# Altium schematic sheet [1]_MCU_Breakout.SchDoc
size A4; Author: Tomislav Ivaniš; Engineer: Tomislav Ivaniš
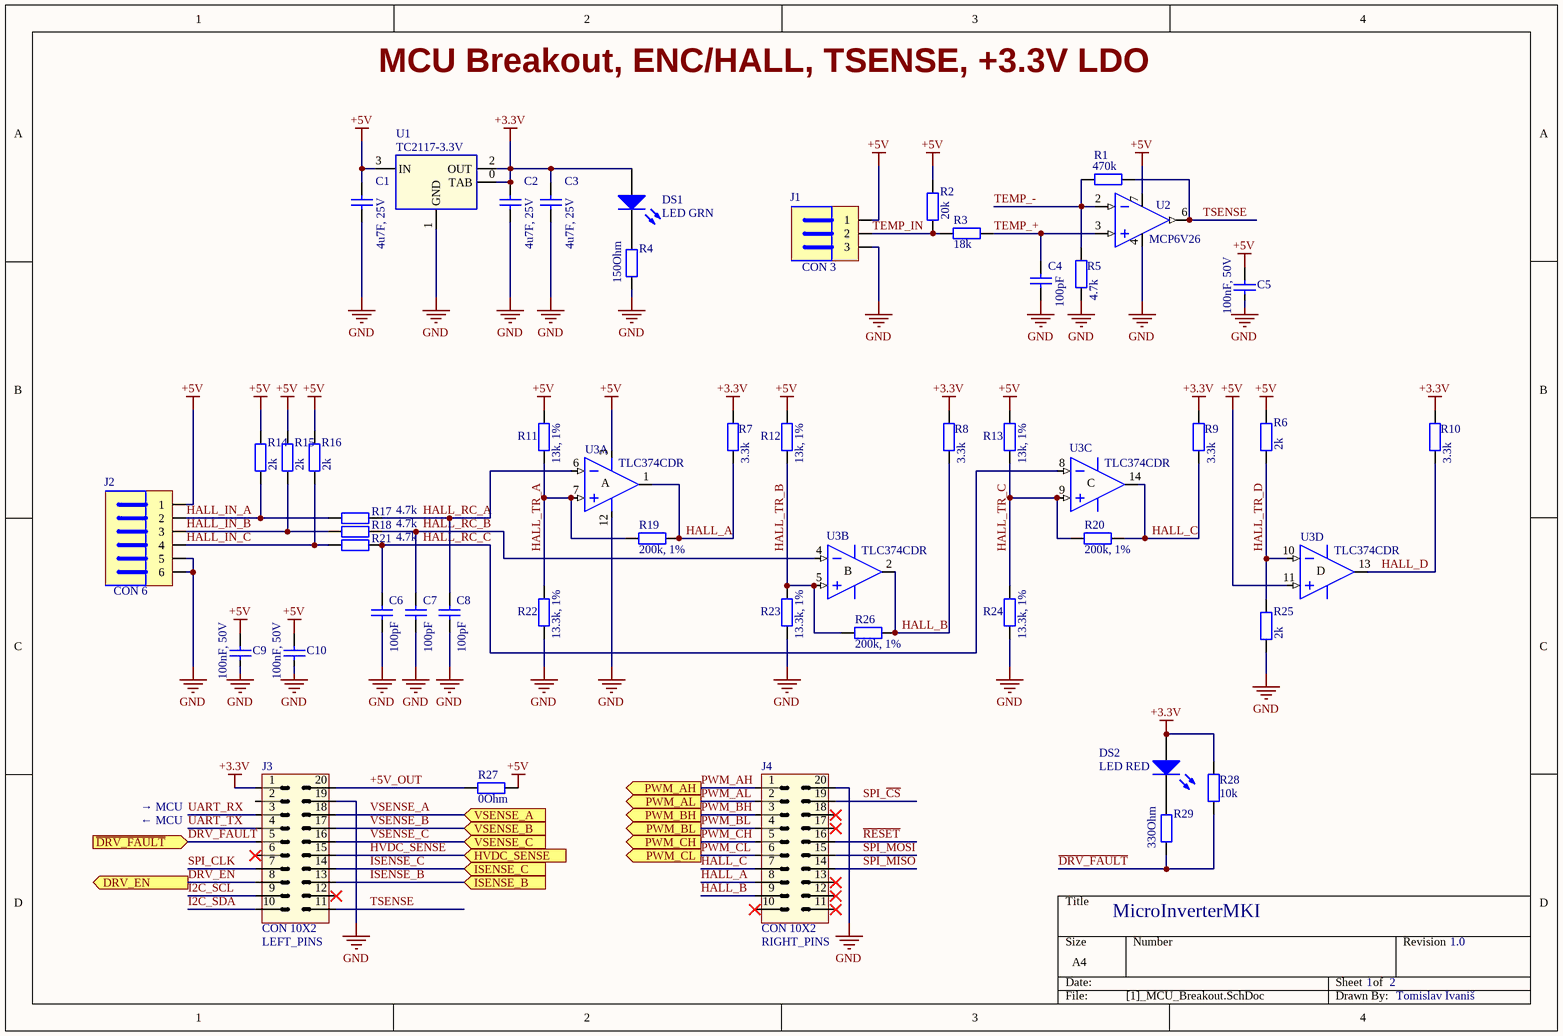
[diagram p0: [1]_MCU_Breakout.SchDoc]

## Parts
C1  4u7F, 25V  [0805]
C2  4u7F, 25V  [0805]
C3  4u7F, 25V  [0805]
C4  100pF  [0603]
C5  100nF, 50V  [0603]
C6  100pF  [0603]
C7  100pF  [0603]
C8  100pF  [0603]
C9  100nF, 50V  [0603]
C10  100nF, 50V  [0603]
DS1  LED GRN  [0805LED]
DS2  LED RED  [0805LED]
J1  CON 3  [CON 3 MOLEX SL]
J2  CON 6  [CON 6 MOLEX SL]
J3  CON 10X2  [CON 20 HEADER - (ALT) - INVERTED]
J4  CON 10X2  [CON 20 HEADER - (ALT) - INVERTED]
R1  470k  [0805]
R2  20k  [0805]
R3  18k  [0805]
R4  150Ohm  [0805]
R5  4.7k  [0805]
R6  2k  [0805]
R7  3.3k  [0805]
R8  3.3k  [0805]
R9  3.3k  [0805]
R10  3.3k  [0805]
R11  13k, 1%  [0805]
R12  13k, 1%  [0805]
R13  13k, 1%  [0805]
R14  2k  [0805]
R15  2k  [0805]
R16  2k  [0805]
R17  4.7k  [0805]
R18  4.7k  [0805]
R19  200k, 1%  [0805]
R20  200k, 1%  [0805]
R21  4.7k  [0805]
R22  13.3k, 1%  [0805]
R23  13.3k, 1%  [0805]
R24  13.3k, 1%  [0805]
R25  2k  [0805]
R26  200k, 1%  [0805]
R27  0Ohm  [0805]
R28  10k  [0805]
R29  330Ohm  [0805]
U1  TC2117-3.3V  [SOT223 (ZLDO)]
U2  MCP6V26  [SOIC 8-pin]
U3  TLC374CDR  [SOIC14]  (parts A,B,C,D of 4)

## Ports
DRV_EN (out), HVDC_SENSE (in), ISENSE_B (in), ISENSE_C (in), PWM_AH (out), PWM_AL (out), PWM_BH (out), PWM_BL (out), PWM_CH (out), PWM_CL (out), VSENSE_A (in), VSENSE_B (in), VSENSE_C (in), ~{DRV_FAULT} (in)

## Nets
+3.3V: C2.1 C3.1 DS1.2(A) DS2.2(A) J3.1 R7.1 R8.1 R9.1 R10.1 R28.2 U1.0(TAB) U1.2(OUT)
+5V: C1.1 C5.1 C9.1 C10.1 J1.1 J2.1 R2.1 R6.1 R11.1 R12.1 R13.1 R14.1 R15.1 R16.1 R27.2 U1.3(IN) U2.7 U3.3(VDD) U3.11(IN+)
GND: C1.2 C2.2 C3.2 C4.2 C5.2 C6.2 C7.2 C8.2 C9.2 C10.2 J1.3 J2.5 J2.6 J3.19 J4.20 R4.2 R5.1 R22.2 R23.2 R24.2 R25.2 U1.1(GND) U2.4 U3.12(GND)
+5V_OUT: J3.20 R27.1
~{DRV_FAULT}: J3.5 R28.1 R29.2 ; port ~{DRV_FAULT}
DRV_EN: J3.8 ; port DRV_EN
HALL_A: J4.8 R7.2 R19.2 U3.1(OUT)
HALL_B: J4.9 R8.2 R26.2 U3.2(OUT)
HALL_C: J4.7 R9.2 R20.2 U3.14(OUT)
HALL_D: R10.2 U3.13(OUT)
HALL_IN_A: J2.2 R14.2 R17.1
HALL_IN_B: J2.3 R15.2 R18.1
HALL_IN_C: J2.4 R16.2 R21.1
HALL_RC_A: C8.1 R17.2 U3.6(IN-)
HALL_RC_B: C7.1 R18.2 U3.4(IN-)
HALL_RC_C: C6.1 R21.2 U3.8(IN-)
HALL_TR_A: R11.2 R19.1 R22.1 U3.7(IN+)
HALL_TR_B: R12.2 R23.1 R26.1 U3.5(IN+)
HALL_TR_C: R13.2 R20.1 R24.1 U3.9(IN+)
HALL_TR_D: R6.2 R25.1 U3.10(IN-)
HVDC_SENSE: J3.15 ; port HVDC_SENSE
I2C_SCL: J3.9
I2C_SDA: J3.10
ISENSE_B: J3.13 ; port ISENSE_B
ISENSE_C: J3.14 ; port ISENSE_C
PWM_AH: J4.1 ; port PWM_AH
PWM_AL: J4.2 ; port PWM_AL
PWM_BH: J4.3 ; port PWM_BH
PWM_BL: J4.4 ; port PWM_BL
PWM_CH: J4.5 ; port PWM_CH
PWM_CL: J4.6 ; port PWM_CL
~{RESET}: J4.16
SPI_~{CS}: J4.19
SPI_CLK: J3.7
SPI_MISO: J4.14
SPI_MOSI: J4.15
TEMP_+: C4.1 R3.2 U2.3(IN+)
TEMP_-: R1.2 R5.2 U2.2(IN-)
TEMP_IN: J1.2 R2.2 R3.1
TSENSE: J3.11 R1.1 U2.6(OUT)
UART_RX: J3.3
UART_TX: J3.4
VSENSE_A: J3.18 ; port VSENSE_A
VSENSE_B: J3.17 ; port VSENSE_B
VSENSE_C: J3.16 ; port VSENSE_C
NetDS1_1: DS1.1(K) R4.1
NetDS2_1: DS2.1(K) R29.1

Not connected (* = marked no-connect by the designer): J3 2 6* 12*; J4 10* 11* 12* 13* 17* 18*

## Notes on the sheet
- MCU Breakout, ENC/HALL, TSENSE, +3.3V LDO
- → MCU
- ← MCU
- MicroInverterMKI
- (near J3) LEFT_PINS
- (near J4) RIGHT_PINS
- 1
- 2
- 1.0
- (in symbol Comparator Quad, part A) A
- (in symbol Comparator Quad, part B) B
- (in symbol Comparator Quad, part C) C
- (in symbol Comparator Quad, part D) D

## Library data of the parts
C1-C3 = Cap Semi: Capacitor; Manufacturer Part Number: 885012107018
C4 C6-C8 = Cap Semi: 885012006036; Manufacturer part number: GCM0335C1E101GA16D
C5 C9 C10 = Cap Semi: Capacitor; Manufacturer Part Number: C0603C104M5RACTU
DS1 = LED: Typical RED, GREEN, YELLOW, AMBER GaAs LED; Manufacturer part number: LTST-S220GKT
DS2 = LED: Typical RED, GREEN, YELLOW, AMBER GaAs LED; Manufacturer part number: LTST-C170KRKT
J1 = CON 3 SIL Angle: Manufacturer part number: 70553-0002
J2 = CON 6 SIL Angle: Manufacturer part number: 70553-0040
J3 J4 = CON 10X2: Manufacturer part number: 68683-305LF
R1 = Res: CR0805-JW-680ELF; Manufacturer part number: CR0805-FX-4703ELF
R2 = Res: CR0805-JW-680ELF; Manufacturer part number: CR0805-FX-2002ELF
R3 = Res: CR0805-JW-680ELF; Manufacturer part number: CR0805-FX-1802ELF
R4 = Res: CR0805-JW-680ELF; Manufacturer part number: CR0805-JW-151ELF
R5 R17 R18 R21 = Res: CR0805-JW-680ELF; Manufacturer part number: CR0805-FX-4701ELF
R6 R14-R16 R25 = Res: CR0805-JW-680ELF; Manufacturer part number: CR0805-FX-2001ELF
R7-R10 = Res: CR0805-JW-680ELF; Manufacturer part number: CR0805-FX-3301ELF
R11-R13 = Res: CR0805-JW-680ELF; Manufacturer part number: CR0805-FX-1302ELF
R19 R20 R26 = Res: CR0805-JW-680ELF; Manufacturer part number: CR0805-FX-2003ELF
R22-R24 = Res: CR0805-JW-680ELF; Manufacturer part number: CR0805-FX-1332ELF
R27 = Res: Resistor; Manufacturer Part Number: CR0805-J/-000ELF
R28 = Res: CR0805-JW-680ELF; Manufacturer part number: CR0805-FX-1002ELF
R29 = Res: CR0805-JW-680ELF; Manufacturer part number: CR0805-FX-3300ELF
U1 = 1117: Linear regulator; Manufacturer part number: TC2117-3.3VDBTR
U2 = OP_AMP_SINGLE_SOIC: Manufacturer Part Number: MCP6V26-E/MS
U3 = Comparator Quad: Comparator, quad, open drain; Manufacturer Part Number: TLC374CDR